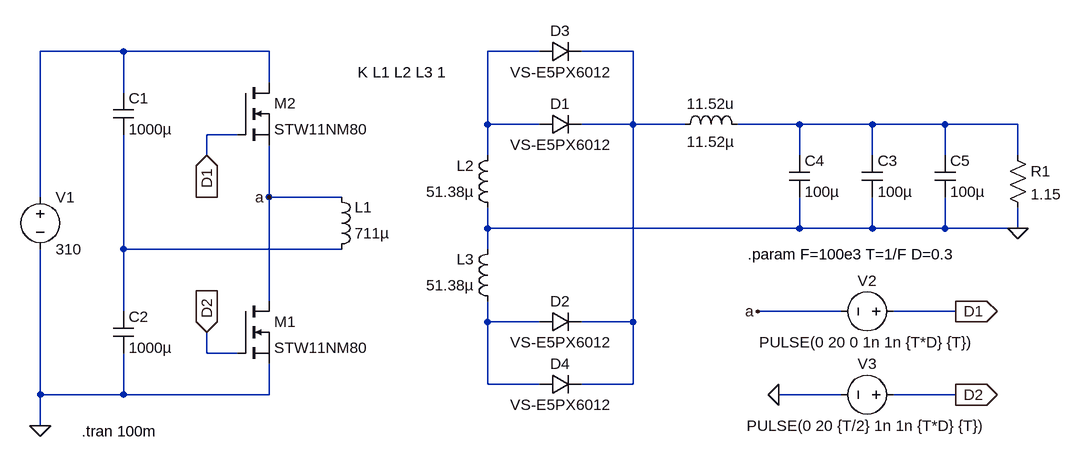
[diagram p0: schematic haft_bridge_v1.asc]
haft_bridge_v1.asc, the LTspice schematic file:
Version 4.1
SHEET 1 1648 680
WIRE 192 -224 64 -224
WIRE 416 -224 192 -224
WIRE 832 -224 752 -224
WIRE 976 -224 896 -224
WIRE 416 -176 416 -224
WIRE 192 -160 192 -224
WIRE 752 -112 752 -224
WIRE 832 -112 752 -112
WIRE 976 -112 976 -224
WIRE 976 -112 896 -112
WIRE 1056 -112 976 -112
WIRE 1232 -112 1136 -112
WIRE 1344 -112 1232 -112
WIRE 1456 -112 1344 -112
WIRE 1568 -112 1456 -112
WIRE 368 -96 320 -96
WIRE 320 -64 320 -96
WIRE 752 -64 752 -112
WIRE 1232 -64 1232 -112
WIRE 1344 -64 1344 -112
WIRE 1456 -64 1456 -112
WIRE 1568 -64 1568 -112
WIRE 64 0 64 -224
WIRE 416 0 416 -80
WIRE 528 0 416 0
WIRE 752 48 752 16
WIRE 1232 48 1232 0
WIRE 1232 48 752 48
WIRE 1344 48 1344 0
WIRE 1344 48 1232 48
WIRE 1456 48 1456 0
WIRE 1456 48 1344 48
WIRE 1568 48 1568 16
WIRE 1568 48 1456 48
WIRE 192 80 192 -96
WIRE 528 80 192 80
WIRE 752 80 752 48
WIRE 416 160 416 0
WIRE 192 176 192 80
WIRE 1296 176 1168 176
WIRE 1472 176 1376 176
WIRE 752 192 752 160
WIRE 832 192 752 192
WIRE 976 192 976 -112
WIRE 976 192 896 192
WIRE 320 240 320 208
WIRE 368 240 320 240
WIRE 752 288 752 192
WIRE 832 288 752 288
WIRE 976 288 976 192
WIRE 976 288 896 288
WIRE 64 304 64 80
WIRE 192 304 192 240
WIRE 192 304 64 304
WIRE 416 304 416 256
WIRE 416 304 192 304
WIRE 1296 304 1200 304
WIRE 1472 304 1376 304
WIRE 64 352 64 304
FLAG 64 352 0
FLAG 320 -64 D1
IOPIN 320 -64 In
FLAG 320 208 D2
IOPIN 320 208 In
FLAG 1472 176 D1
IOPIN 1472 176 Out
FLAG 1200 304 0
FLAG 1472 304 D2
IOPIN 1472 304 Out
FLAG 1568 48 0
FLAG 416 0 a
FLAG 1168 176 a
SYMBOL voltage 64 -16 R0
WINDOW 123 0 0 Left 0
WINDOW 39 0 0 Left 0
SYMATTR InstName V1
SYMATTR Value 310
SYMBOL nmos 368 160 R0
SYMATTR InstName M1
SYMATTR Value STW11NM80
SYMBOL nmos 368 -176 R0
SYMATTR InstName M2
SYMATTR Value STW11NM80
SYMBOL diode 832 -96 R270
WINDOW 0 32 32 VTop 2
WINDOW 3 0 32 VBottom 2
SYMATTR InstName D1
SYMATTR Value VS-E5PX6012
SYMBOL ind 1040 -96 R270
WINDOW 0 32 56 VTop 2
WINDOW 3 5 56 VBottom 2
SYMATTR InstName 11.52u
SYMATTR Value 11.52µ
SYMBOL cap 1328 -64 R0
SYMATTR InstName C3
SYMATTR Value 100µ
SYMBOL res 1552 -80 R0
SYMATTR InstName R1
SYMATTR Value 1.15
SYMBOL diode 832 208 R270
WINDOW 0 32 32 VTop 2
WINDOW 3 0 32 VBottom 2
SYMATTR InstName D2
SYMATTR Value VS-E5PX6012
SYMBOL voltage 1392 176 R90
WINDOW 0 -32 56 VBottom 2
WINDOW 3 32 56 VTop 2
WINDOW 123 0 0 Left 0
WINDOW 39 0 0 Left 0
SYMATTR InstName V2
SYMATTR Value PULSE(0 20 0 1n 1n {T*D} {T})
SYMBOL voltage 1392 304 R90
WINDOW 0 -32 56 VBottom 2
WINDOW 3 32 56 VTop 2
WINDOW 123 0 0 Left 0
WINDOW 39 0 0 Left 0
SYMATTR InstName V3
SYMATTR Value PULSE(0 20 {T/2} 1n 1n {T*D} {T})
SYMBOL cap 1216 -64 R0
SYMATTR InstName C4
SYMATTR Value 100µ
SYMBOL cap 1440 -64 R0
SYMATTR InstName C5
SYMATTR Value 100µ
SYMBOL diode 832 -208 R270
WINDOW 0 32 32 VTop 2
WINDOW 3 0 32 VBottom 2
SYMATTR InstName D3
SYMATTR Value VS-E5PX6012
SYMBOL diode 832 304 R270
WINDOW 0 32 32 VTop 2
WINDOW 3 0 32 VBottom 2
SYMATTR InstName D4
SYMATTR Value VS-E5PX6012
SYMBOL ind 512 96 M180
WINDOW 0 36 80 Left 2
WINDOW 3 36 40 Left 2
SYMATTR InstName L1
SYMATTR Value 711µ
SYMATTR Type ind
SYMBOL ind 768 32 R180
WINDOW 0 36 80 Left 2
WINDOW 3 36 40 Left 2
SYMATTR InstName L2
SYMATTR Value 51.38µ
SYMATTR Type ind
SYMBOL ind 768 176 R180
WINDOW 0 36 80 Left 2
WINDOW 3 36 40 Left 2
SYMATTR InstName L3
SYMATTR Value 51.38µ
SYMATTR Type ind
SYMBOL cap 176 -160 R0
SYMATTR InstName C1
SYMATTR Value 1000µ
SYMBOL cap 176 176 R0
SYMATTR InstName C2
SYMATTR Value 1000µ
TEXT 1152 88 Left 2 !.param F=100e3 T=1/F D=0.3
TEXT 552 -192 Left 2 !K L1 L2 L3 1
TEXT 128 360 Left 2 !.tran 100m

The netlist it stands for:
* haft_bridge_v1.asc
V1 N001 0 310
M1 a D2 0 0 STW11NM80
M2 N001 D1 a a STW11NM80
D1 N002 N003 VS-E5PX6012
L§11.52u N003 N004 11.52µ
C3 N004 0 100µ
R1 N004 0 1.15
D2 N006 N003 VS-E5PX6012
V2 D1 a PULSE(0 20 0 1n 1n {T*D} {T})
V3 D2 0 PULSE(0 20 {T/2} 1n 1n {T*D} {T})
C4 N004 0 100µ
C5 N004 0 100µ
D3 N002 N003 VS-E5PX6012
D4 N006 N003 VS-E5PX6012
L1 N005 a 711µ
L2 0 N002 51.38µ
L3 N006 0 51.38µ
C1 N001 N005 1000µ
C2 N005 0 1000µ
.model D D
.lib standard.dio
.model NMOS NMOS
.model PMOS PMOS
.lib standard.mos
.param F=100e3 T=1/F D=0.3
K L1 L2 L3 1
.tran 100m
.backanno
.end